# EAGLE design EMG_V1A (EAGLE 9.6.2)
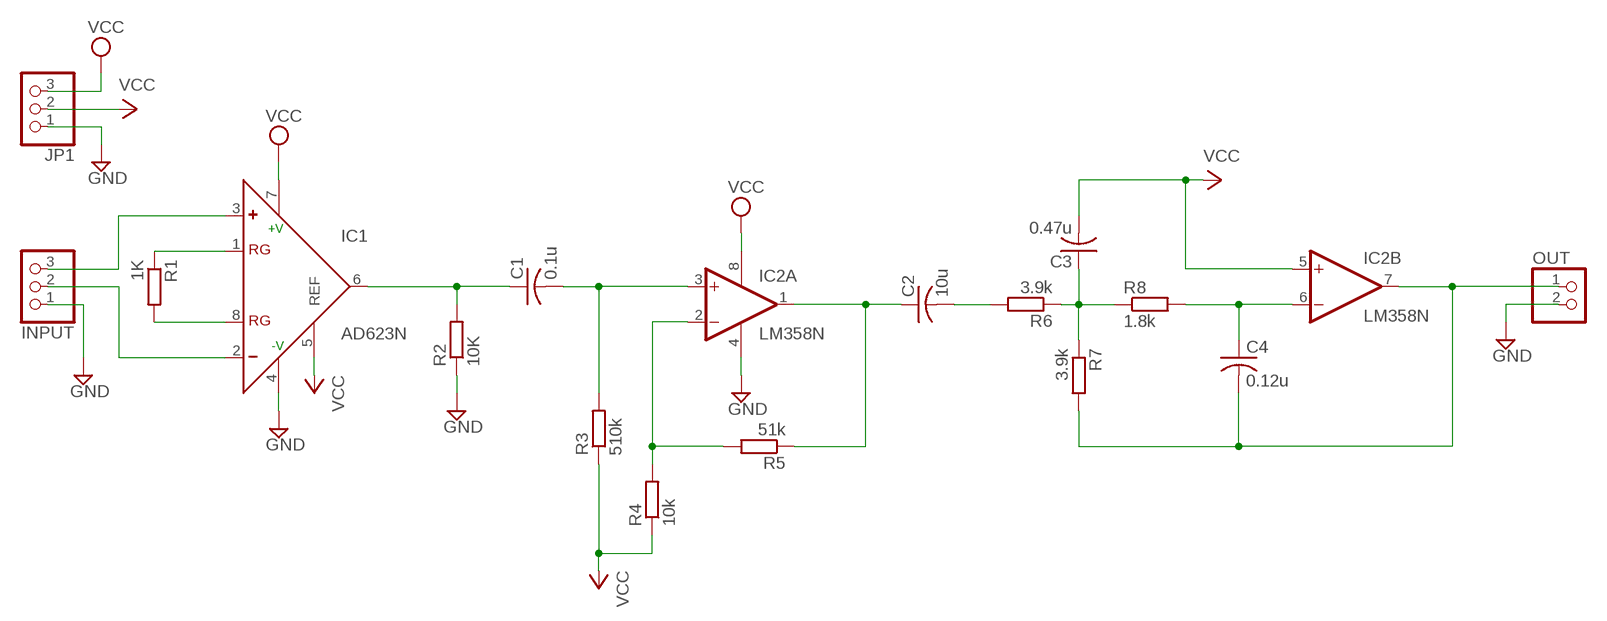
[diagram p0: schematic, sheet 1]

## Parts
C1  0.1u  C-US050-030X075  [C050-030X075]
C2  10u  C-US050-030X075  [C050-030X075]
C3  0.47u  C-US050-030X075  [C050-030X075]
C4  0.12u  C-US050-030X075  [C050-030X075]
IC1  AD623N  [DIL08]
IC2  LM358N  [DIL08]
INPUT  PINHD-1X3  [1X03]
JP1  PINHD-1X3  [1X03]
OUT  PINHD-1X2  [1X02]
R1  1K  R-EU_0204/7  [0204/7]
R2  10K  R-EU_0204/7  [0204/7]
R3  510k  R-EU_0204/7  [0204/7]
R4  10k  R-EU_0204/7  [0204/7]
R5  51k  R-EU_0204/7  [0204/7]
R6  3.9k  R-EU_0204/7  [0204/7]
R7  3.9k  R-EU_0204/7  [0204/7]
R8  1.8k  R-EU_0204/7  [0204/7]

## Nets
GND: IC1.4(-V) IC2.4(P:V-) INPUT.1 JP1.1 OUT.2 R2.1
N$1: IC1.1(RG) R1.1
N$2: IC1.8(RG) R1.2
N$3: IC1.3(+) INPUT.3
N$4: IC1.2(-) INPUT.2
N$5: C1.1 IC1.6(OUT) R2.2
N$6: C1.2 IC2.3(A:+IN) R3.2
N$7: IC2.2(A:-IN) R4.2 R5.2
N$8: C2.2 R6.2
N$9: C2.1 IC2.1(A:OUT) R5.1
N$10: C3.1 R6.1 R7.1 R8.1
N$11: C4.1 IC2.6(B:-IN) R8.2
N$13: C4.2 IC2.7(B:OUT) OUT.1 R7.2
VCC: C3.2 IC1.5(REF) IC1.7(+V) IC2.5(B:+IN) IC2.8(P:V+) JP1.2 JP1.3 R3.1 R4.1

## Library data of the parts
C1-C4 = rcl:C-US: CAPACITOR, American symbol; SPICEPREFIX: C
IC1 = analog-devices:AD623: Single-Supply, Rail-to-Rail, Low Cost Instrumentation Amplifier Source: http://www.analog.com/static/imported-files/data_sheets/AD623.pdf; MF: ALTERA CORPORATION; MPN: AD623ANZ; OC_FARNELL: 9603700; OC_NEWARK: 59K4402
IC2 = linear:LM358: OP AMP also LM158; LM258; LM2904 Source: http://cache.national.com/ds/LM/LM158.pdf
INPUT JP1 = pinhead:PINHD-1X3: PIN HEADER
OUT = pinhead:PINHD-1X2: PIN HEADER
R1-R8 = rcl:R-EU_: RESISTOR, European symbol; SPICEPREFIX: R

## Board
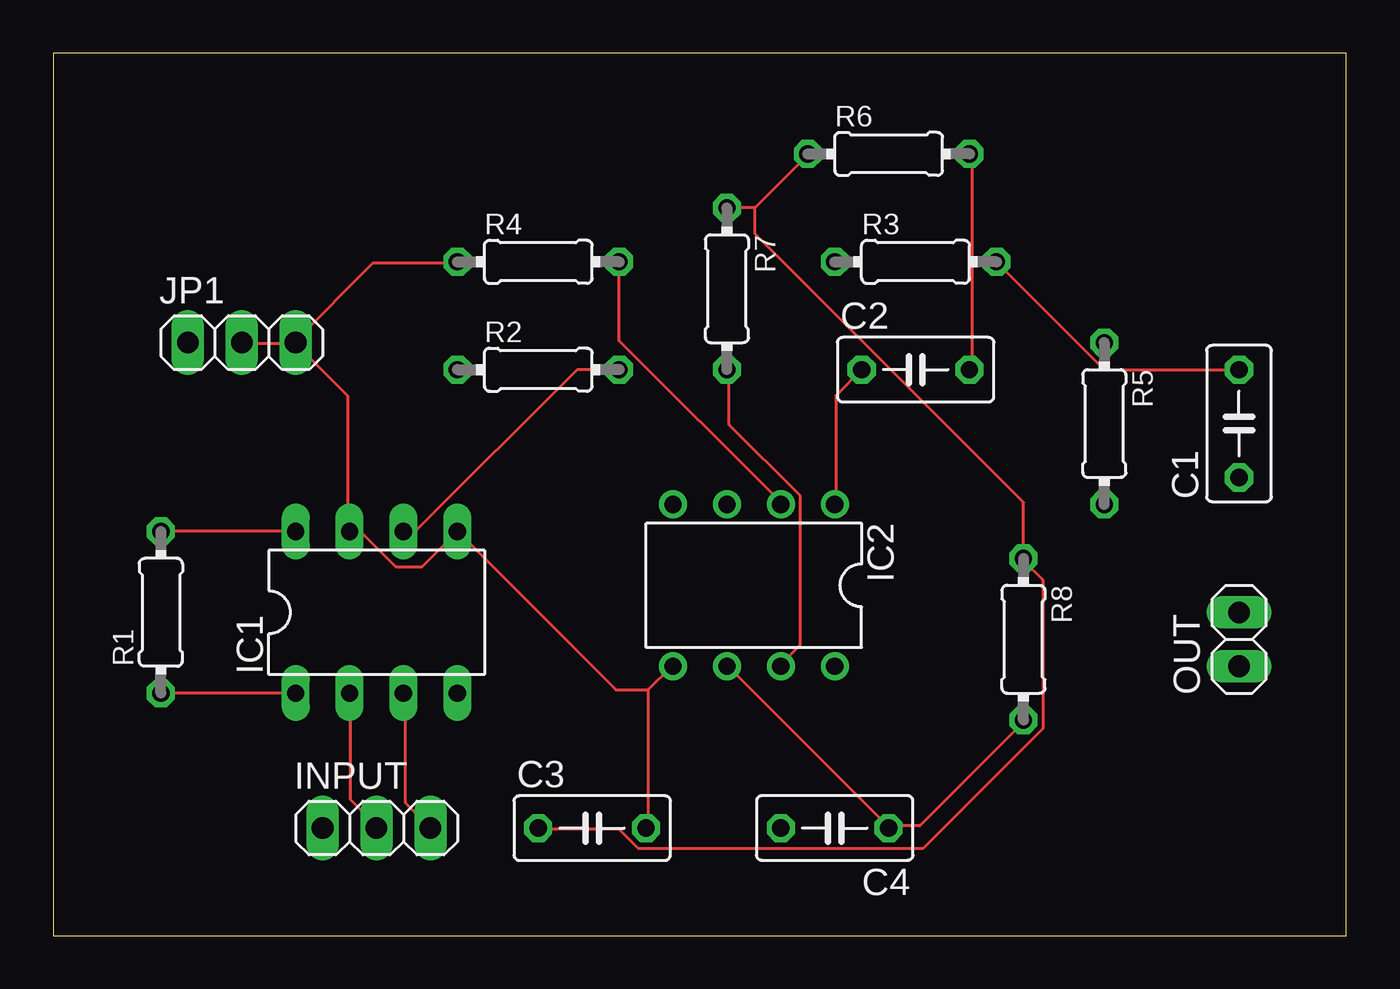
[diagram p1: board, top side]
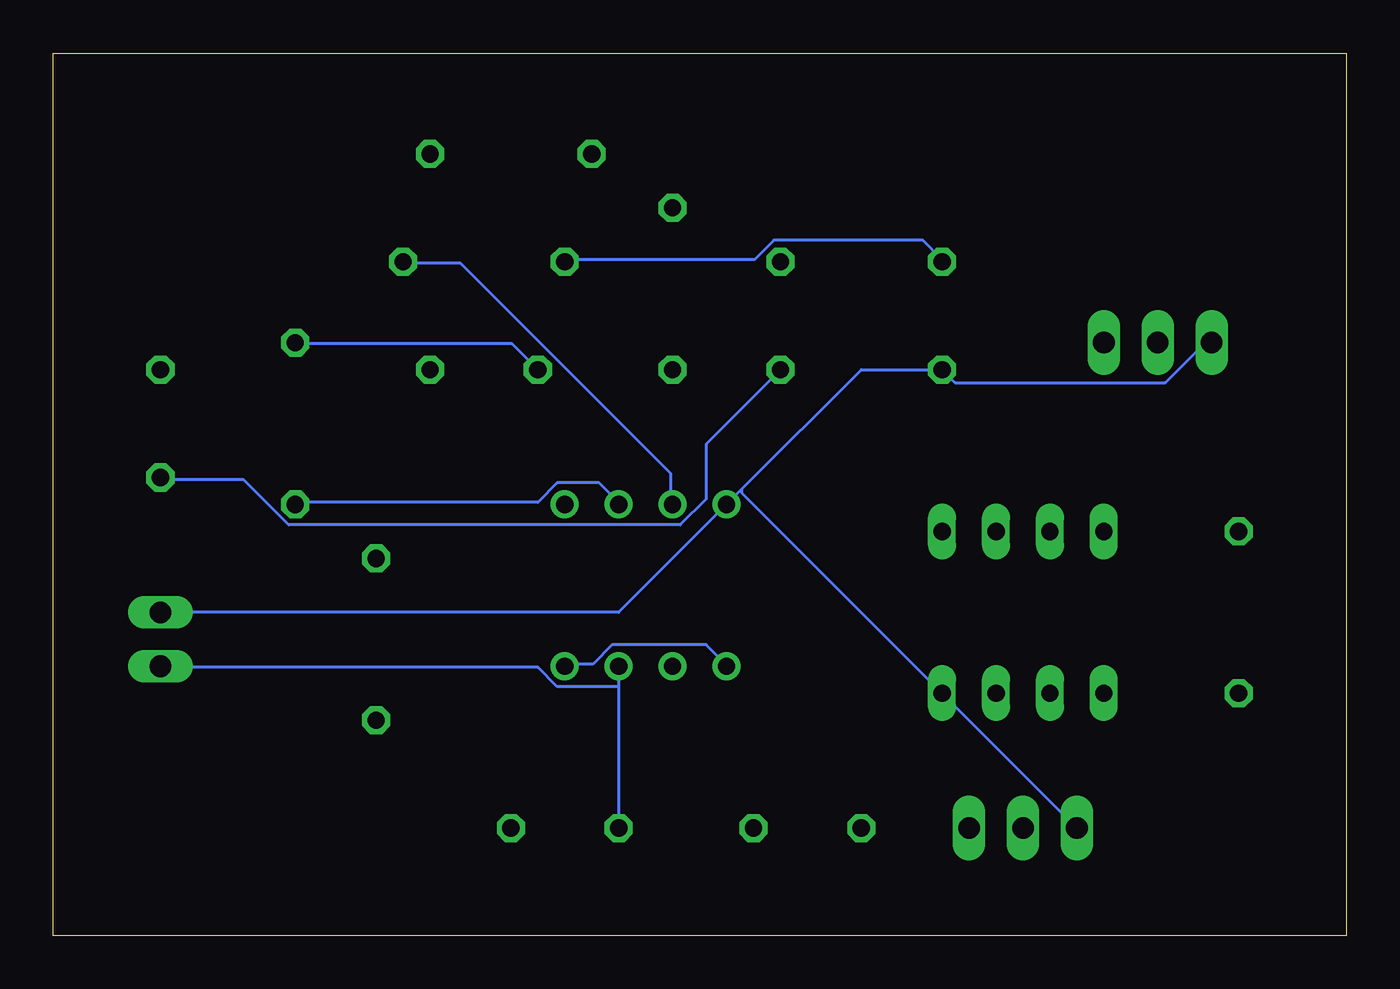
[diagram p2: board, bottom side, seen from below]

Size 60.94 x 41.58 mm. Coordinates in mm from the lower left corner, seen from the top.
Outline: 0,0 60.94,0 60.94,41.58 0,41.58 0,0
Copper layers (1*16): Top 0.035mm / dielectric 1.5mm / Bottom 0.035mm
Design rules "default": minimum track width 6mil, minimum drill 0.35mm, track to track 6mil, track to pad 6mil, pad to pad 6mil, via to via 6mil, smd to smd 6mil, copper to edge 40mil, drill to drill 6mil, minimum pad ring 10mil, minimum via ring 8mil, stop-mask expansion 4mil, vias tented up to drill 0mil, thermal gap 10mil

### Footprints (pad centres in the part's own frame; a part is rotated, then mirrored left to right if it is on the bottom)
C050-030X075 = drill 0.813 octagon: 1 -2.54,0; 2 2.54,0
DIL08 = drill 0.813 long: 1 -3.81,-3.81; 2 -1.27,-3.81; 3 1.27,-3.81; 4 3.81,-3.81; 5 3.81,3.81; 6 1.27,3.81; 7 -1.27,3.81; 8 -3.81,3.81
DIL08' = drill 0.813 pad 1.27: 1 -3.81,-3.81; 2 -1.27,-3.81; 3 1.27,-3.81; 4 3.81,-3.81; 5 3.81,3.81; 6 1.27,3.81; 7 -1.27,3.81; 8 -3.81,3.81
1X03 = drill 1.016 long: 1 -2.54,0; 2 0,0; 3 2.54,0
1X02 = drill 1.016 long: 1 -1.27,0; 2 1.27,0
0204/7 = drill 0.813 octagon: 1 -3.81,0; 2 3.81,0

### Placement (x,y rotation side)
C1  55.88,24.13 90 top
C2  40.64,26.67 0 top
C3  25.4,5.08 0 top
C4  36.83,5.08 180 top
IC1  15.24,15.24 0 top
IC2  LM358N  [DIL08']  33.02,16.51 180 top
INPUT  15.24,5.08 0 top
JP1  8.89,27.94 0 top
OUT  55.88,13.97 90 top
R1  5.08,15.24 90 top
R2  22.86,26.67 0 top
R3  40.64,31.75 0 top
R4  22.86,31.75 0 top
R5  49.53,24.13 270 top
R6  39.37,36.83 0 top
R7  31.75,30.48 270 top
R8  45.72,13.97 270 top

### Tracks (layer width: path | path; a pad name or v marks a point on that pad's centre or on a via)
GND
  Bottom 0.152: INPUT.1 IC1.4 28.5,20.88 28.5,21.03 | 28.5,21.03 IC2.4 34.29,15.24 OUT.2 | 28.5,21.03 22.86,26.67 R2.1 18.44,26.06 8.53,26.06 6.71,27.89 6.4,27.89 JP1.1
N$1
  Top 0.152: IC1.1 R1.1
N$2
  Top 0.152: IC1.8 R1.2
N$3
  Top 0.152: INPUT.3 16.61,6.25 16.61,11.43 IC1.3
N$4
  Top 0.152: IC1.2 14.02,11.43 14.02,6.4 15.24,5.18 INPUT.2
N$5
  Top 0.152: IC1.6 17.07,19.05 24.69,26.67 R2.2
  Bottom 0.152: R2.2 30.18,23.16 30.18,20.57 31.39,19.36 49.84,19.36 51.97,21.49 55.78,21.49 C1.1
N$6
  Top 0.152: C1.2 49.53,26.67 R3.2
  Bottom 0.152: IC2.3 31.85,20.42 31.85,21.79 41.76,31.7 44.35,31.7 R3.2
N$7
  Top 0.152: R4.2 26.67,28.04 34.29,20.42 IC2.2
  Bottom 0.152: R5.2 49.53,20.42 38.1,20.42 37.19,21.34 35.2,21.34 34.29,20.42 IC2.2
N$8
  Top 0.152: C2.2 43.28,26.67 43.28,36.73 R6.2
N$9
  Top 0.152: C2.1 36.88,25.45 36.88,20.42 IC2.1
  Bottom 0.152: C2.1 39.32,27.89 49.53,27.89 R5.1
N$10
  Top 0.152: 33.07,34.29 R7.1 | 33.07,34.29 35.51,36.73 R6.1 | C3.1 22.86,5.03 26.67,5.03 27.58,4.12 41,4.12 46.63,9.75 46.63,16.76 45.72,17.68 R8.1 45.72,20.42 33.07,33.07 33.07,34.29
N$11
  Top 0.152: R8.2 45.72,10.06 40.84,5.18 39.47,5.18 C4.1 39.32,5.18 31.85,12.65 IC2.6
N$13
  Top 0.152: R7.2 31.85,26.67 31.85,24.08 35.2,20.73 35.2,13.72 34.29,12.8 IC2.7
  Bottom 0.152: IC2.7 34.29,11.73 | 34.29,11.73 C4.2 | 34.29,11.73 37.19,11.73 38.1,12.65 55.78,12.65 OUT.1
VCC
  Top 0.152: 28.04,11.58 28.04,5.18 C3.2 | 28.04,11.58 29.11,12.65 IC2.5 | R4.1 19.05,31.7 15.09,31.7 11.43,28.04 JP1.3 11.43,27.89 | 11.43,27.89 8.99,27.89 JP1.2 | 11.43,27.89 13.87,25.45 13.87,19.05 IC1.7 14.48,19.05 16.15,17.37 17.37,17.37 IC1.5 26.52,11.58 28.04,11.58
  Bottom 0.152: IC2.8 36.73,12.8 35.51,12.8 34.59,13.72 30.18,13.72 29.26,12.8 IC2.5 | R3.1 36.73,31.85 27.89,31.85 26.98,32.77 19.96,32.77 19.05,31.85 R4.1